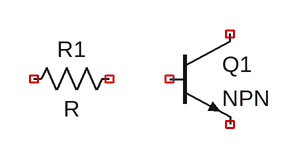
[diagram p0: schematic Draft1.asc]
Draft1.asc, the LTspice schematic file:
Version 4
SHEET 1 880 680
SYMBOL npn 224 80 R0
SYMATTR InstName Q1
SYMBOL res 176 112 R90
WINDOW 0 0 56 VBottom 2
WINDOW 3 32 56 VTop 2
SYMATTR InstName R1

The netlist it stands for:
* Draft1.asc
Q1 NC_01 NC_02 NC_03 0 NPN
R1 NC_04 NC_05 R
.model NPN NPN
.model PNP PNP
.lib standard.bjt
.backanno
.end